# Altium schematic sheet PicoPrint-Power.SchDoc
size A3; DocumentNumber: 2; SheetNumber: 2; SheetTotal: 5
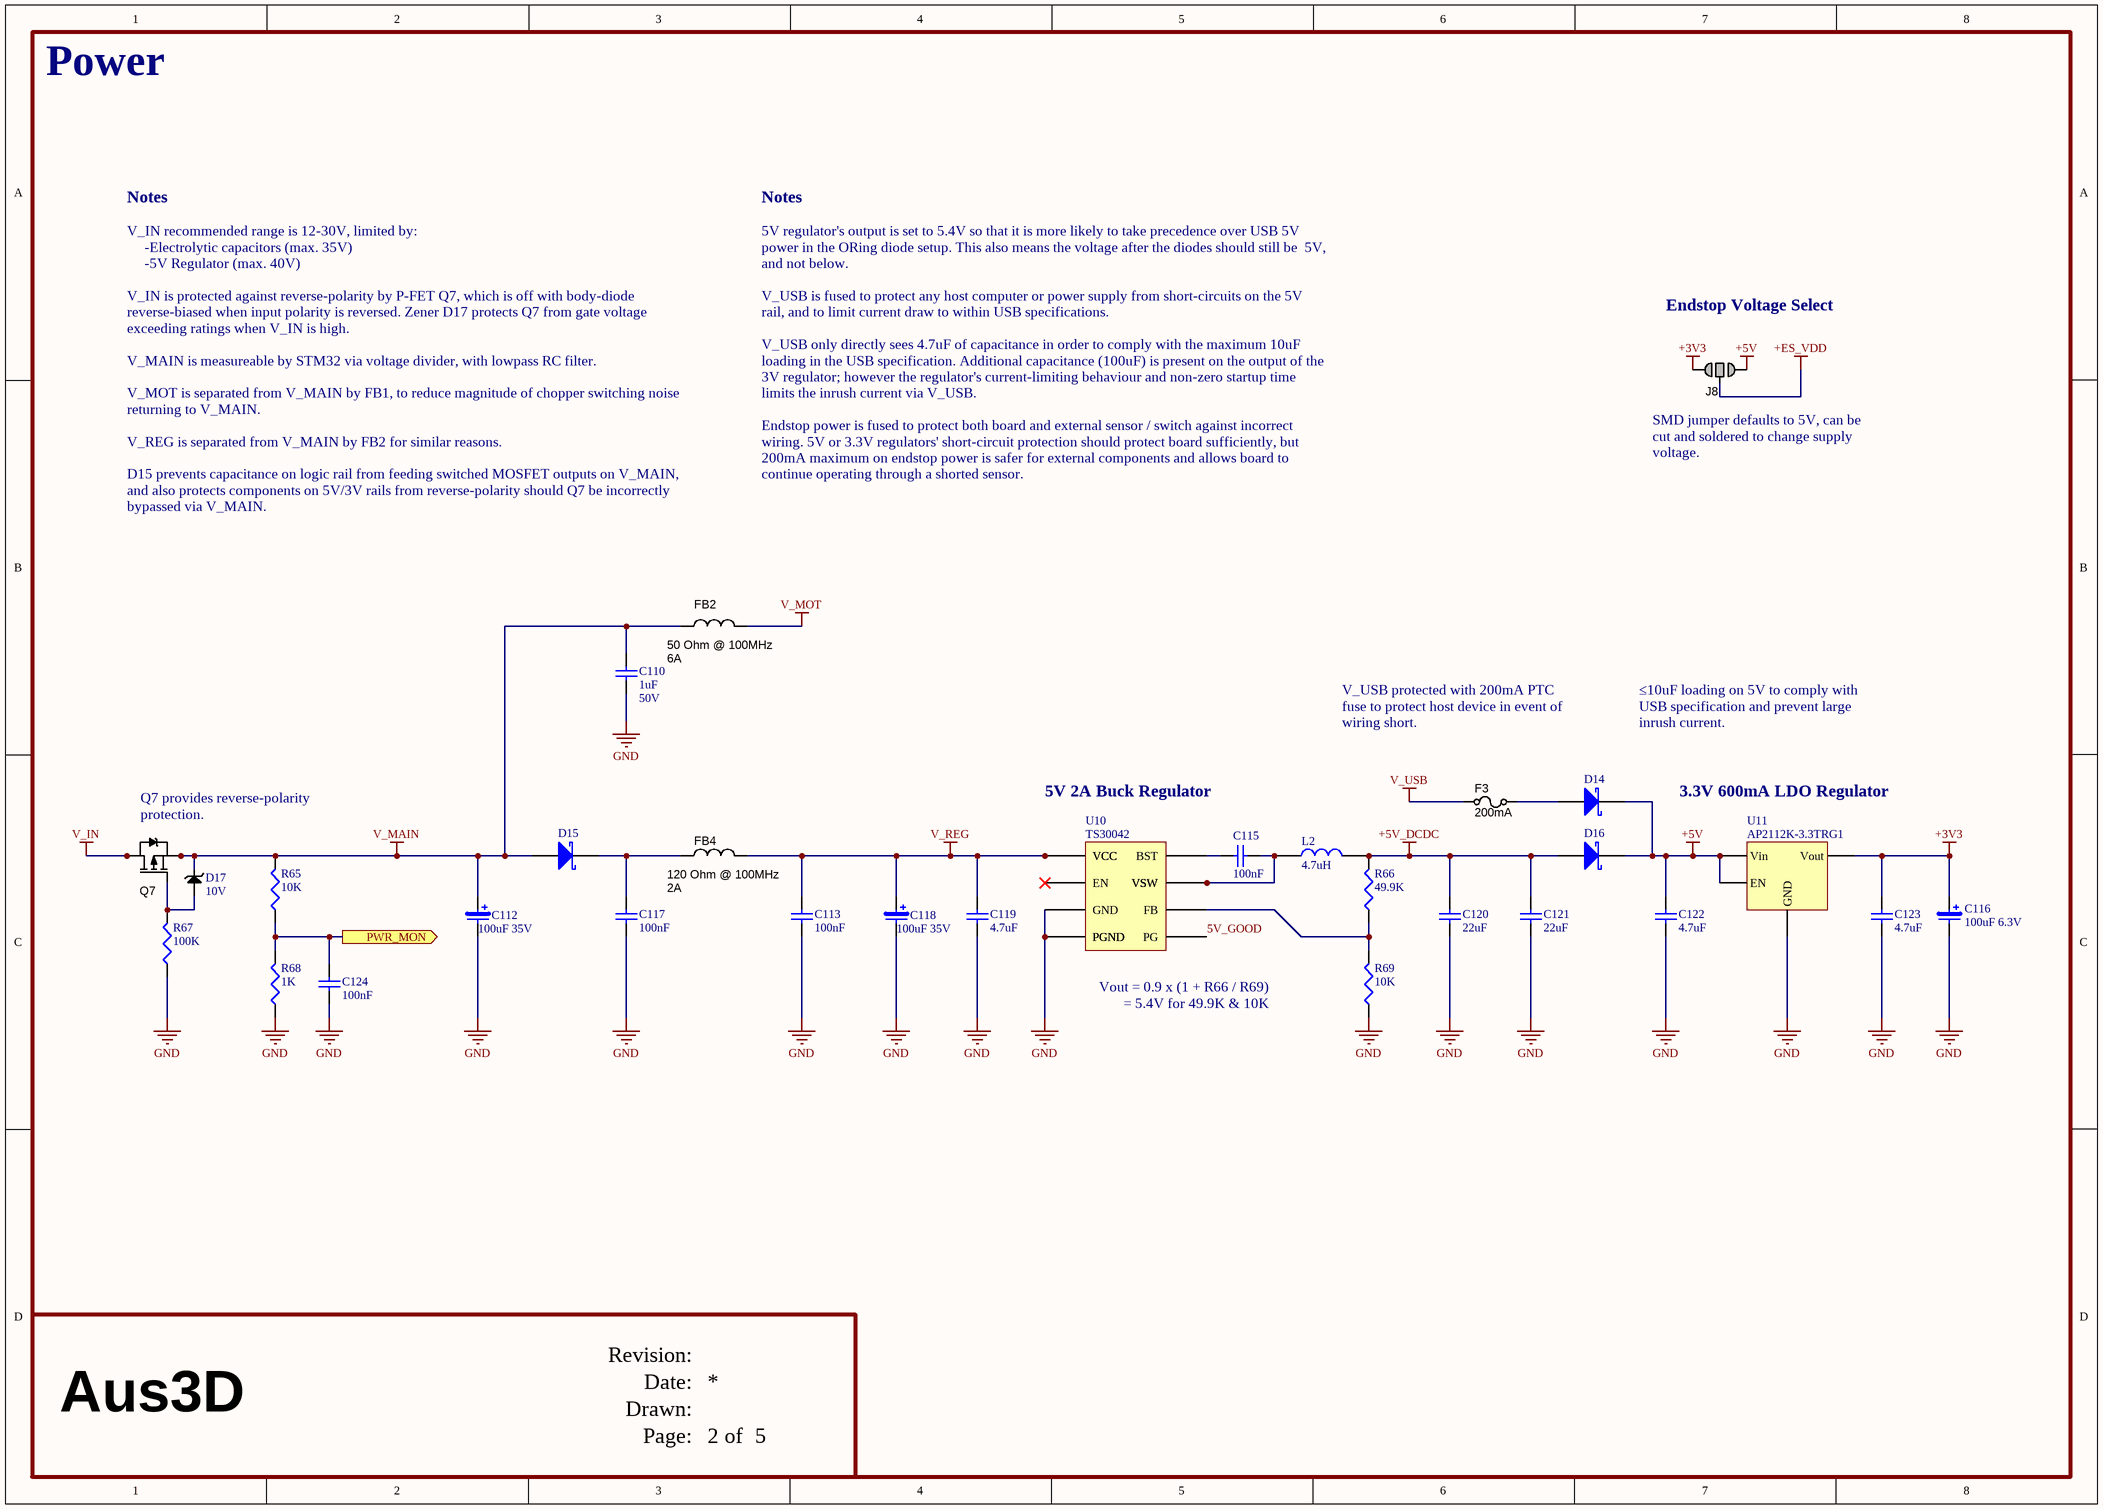
[diagram p0: PicoPrint-Power.SchDoc]

## Parts
C110  value 1uF  Voltage: 50V  [Cap 1608-0603]  (hidden comment: CapC-0603-1uF 50V)
C112  value 100uF 35V  [CAP EL PANASONIC]  (hidden comment: CapE-6.3-100uF-35V)
C113  value 100nF  [CAP 1005-0402]  (hidden comment: CapC-0402-100nF-50V)
C115  value 100nF  [CAP 1005-0402]  (hidden comment: CapC-0402-100nF)
C116  value 100uF 6.3V  [CAP EL 5mm]  (hidden comment: CapE-5.0-100uF-6.3V)
C117  value 100nF  [CAP 1005-0402]  (hidden comment: CapC-0402-100nF-50V)
C118  value 100uF 35V  [CAP EL PANASONIC]  (hidden comment: CapE-6.3-100uF-35V)
C119  value 4.7uF  [CAP 3225-1210]  (hidden comment: CapC-1210-4.7uF-50V)
C120  value 22uF  [CAPC2012X135N]  (hidden comment: CapC-0805-22uF 6.3V)
C121  value 22uF  [CAPC2012X135N]  (hidden comment: CapC-0805-22uF 6.3V)
C122  value 4.7uF  [CAP 1005-0402]  (hidden comment: CapC-0402-4.7uF-10V)
C123  value 4.7uF  [CAP 1005-0402]  (hidden comment: CapC-0402-4.7uF-10V)
C124  value 100nF  [CAP 1005-0402]  (hidden comment: CapC-0402-100nF)
D14  Schottky 2A 40V SOD-123F  [DIOM2616X08N]  (value not drawn)
D15  Schottky 2A 40V SOD-123F  [DIOM2616X08N]  (value not drawn)
D16  Schottky 2A 40V SOD-123F  [DIOM2616X08N]  (value not drawn)
D17  Voltage: 10V  [SOD523]  (hidden comment: Zener 10V 150mW SOD523)
F3  value 200mA  [RES 3216-1206]  (hidden comment: PTC Resettable Fuse)
FB2  Impedance @ Frequency: 50 Ohm @ 100MHz  Current Rating: 6A  [INDC3216X13N]  (hidden comment: 50R @ 100 MHz)
FB4  Impedance @ Frequency: 120 Ohm @ 100MHz  Current Rating: 2A  [INDC1608N]  (hidden comment: 120R @ 100 MHz)
J8  Jumper  [JUMPER-3-NO]  (value not drawn)  (no BOM)
L2  value 4.7uH  [INDUCTOR_NRS5030T4R7MMGJ]  (hidden comment: Inductor SMD 4.7uH 2.6A)
Q7  SI7111EDN-T1-GE3  [PowerPAK 1218-8 Single]  (value not drawn)
R65  value 10K  [RESC1005X40N]  (hidden comment: Res-0402-10K)
R66  value 49.9K  [RESC1005X40N]  (hidden comment: Res-0402-49.9K)
R67  value 100K  [RESC1005X40N]  (hidden comment: Res-0402-100K)
R68  value 1K  [RESC1005X40N]  (hidden comment: Res-0402-1K)
R69  value 10K  [RESC1005X40N]  (hidden comment: Res-0402-10K)
U10  TS30042  [QFN50P300X300X100_HS-17N]
U11  AP2112K-3.3TRG1  [SOT23-5]

## Ports
PWR_MON (out)

## Nets
+3V3: C116.1 C123.2 J8.1 U11.5(Vout)
+5V: C122.2 D14.K D16.K J8.3 U11.1(Vin) U11.3(EN)
+5V_DCDC: C120.2 C121.2 D16.A L2.2 R66.2
+ES_VDD: J8.2
GND: C110.1 C112.2 C113.1 C116.2 C117.1 C118.2 C119.1 C120.1 C121.1 C122.1 C123.1 C124.1 R67.1 R68.1 R69.1 U10.4(GND) U10.14(PGND) U10.15(PGND) U10.17(PGND) U11.2(GND)
V_IN: Q7.5(D) Q7.6(D) Q7.7(D) Q7.8(D) Q7.9(D)
V_MAIN: C110.2 C112.1 D15.A D17.K FB2.1 Q7.1(S) Q7.2(S) Q7.3(S) R65.2
V_MOT: FB2.2
V_REG: C113.2 C118.1 C119.2 FB4.2 U10.2(VCC) U10.3(VCC) U10.11(VCC)
V_USB: F3.1
5V_GOOD: U10.8(PG)
PWR_MON: C124.2 R65.1 R68.2 ; port PWR_MON
NetC115_1: C115.1 U10.10(BST)
NetC115_2: C115.2 L2.1 U10.1(VSW) U10.12(VSW) U10.13(VSW) U10.16(VSW)
NetC117_2: C117.2 D15.K FB4.1
NetD14_A: D14.A F3.2
NetD17_A: D17.A Q7.4(G) R67.2
NetR66_1: R66.1 R69.2 U10.5(FB)

Not connected (* = marked no-connect by the designer): U10 9(EN)*

## Notes on the sheet
- Power
- Notes
- Endstop Voltage Select
- 5V regulator's output is set to 5.4V so that it is more likely to take precedence over USB 5V power in the ORing diode setup. This also means the voltage after the diodes should still be  5V, and not below.
  V_USB is fused to protect any host computer or power supply from short-circuits on the 5V rail, and to limit current draw to within USB specifications.
  V_USB only directly sees 4.7uF of capacitance in order to comply with the maximum 10uF loading in the USB specification. Additional capacitance (100uF) is present on the output of the 3V regulator; however the regulator's current-limiting behaviour and non-zero startup time limits the inrush current via V_USB.
  Endstop power is fused to protect both board and external sensor / switch against incorrect wiring. 5V or 3.3V regulators' short-circuit protection should protect board sufficiently, but 200mA maximum on endstop power is safer for external components and allows board to continue operating through a shorted sensor.
- (near J8) SMD jumper defaults to 5V, can be cut and soldered to change supply voltage.
- V_IN recommended range is 12-30V, limited by:
  -Electrolytic capacitors (max. 35V)
  -5V Regulator (max. 40V)
  V_IN is protected against reverse-polarity by P-FET Q7, which is off with body-diode reverse-biased when input polarity is reversed. Zener D17 protects Q7 from gate voltage exceeding ratings when V_IN is high.
  V_MAIN is measureable by STM32 via voltage divider, with lowpass RC filter.
  V_MOT is separated from V_MAIN by FB1, to reduce magnitude of chopper switching noise returning to V_MAIN.
  V_REG is separated from V_MAIN by FB2 for similar reasons.
  D15 prevents capacitance on logic rail from feeding switched MOSFET outputs on V_MAIN, and also protects components on 5V/3V rails from reverse-polarity should Q7 be incorrectly bypassed via V_MAIN.
- V_USB protected with 200mA PTC fuse to protect host device in event of wiring short.
- ≤10uF loading on 5V to comply with USB specification and prevent large inrush current.
- Q7 provides reverse-polarity protection.
- 5V 2A Buck Regulator
- 3.3V 600mA LDO Regulator
- Vout = 0.9 x (1 + R66 / R69)
  = 5.4V for 49.9K & 10K
- Date:
- Revision:
- Aus3D
- Drawn:
- Page:
- of

## Library data of the parts
C110 = CapC-0603-1uF 50V: Capacitor (SMD Ceramic); Note: Approved sub OK; Published: 8-Jun-2000; Revision: July-2002: Re-released for DXP Platform.; Publisher: Altium Limited; Supplier 1: Digi-Key; Supplier Part Number 1: 1276-1860-1-ND
C112 C118 = CapE-6.3-100uF-35V: Capacitor (SMD Polarised Electrolytic); Note: Approved sub OK; Published: 8-Jun-2000; Revision: July-2002: Re-released for DXP Platform.; Publisher: Altium Limited; Supplier 1: Digi-Key; Supplier Part Number 1: PCE5016CT-ND
C113 C117 = CapC-0402-100nF-50V: Capacitor (SMD Ceramic); Voltage: 50V; Note: Approved sub OK; Published: 8-Jun-2000; Revision: July-2002: Re-released for DXP Platform.; Publisher: Altium Limited; Supplier 1: Digi-Key; Supplier Part Number 1: 490-10700-1-ND
C115 C124 = CapC-0402-100nF: Capacitor (SMD Ceramic); Note: Approved sub OK; Published: 8-Jun-2000; Revision: July-2002: Re-released for DXP Platform.; Publisher: Altium Limited; Supplier 1: Digi-Key; Supplier Part Number 1: 311-1336-1-ND
C116 = CapE-5.0-100uF-6.3V: Capacitor (SMD Polarised Electrolytic); Note: Approved sub OK; Published: 8-Jun-2000; Revision: July-2002: Re-released for DXP Platform.; Publisher: Altium Limited; Supplier 1: Digi-Key; Supplier Part Number 1: 565-2057-1-ND
C119 = CapC-1210-4.7uF-50V: Capacitor (SMD Ceramic); Note: Approved sub OK; Published: 8-Jun-2000; Revision: July-2002: Re-released for DXP Platform.; Publisher: Altium Limited; Supplier 1: Digi-Key; Supplier Part Number 1: 490-1864-1-ND
C120 C121 = CapC-0805-22uF 6.3V: Capacitor (SMD Ceramic); Note: Approved sub OK; Published: 8-Jun-2000; Revision: July-2002: Re-released for DXP Platform.; Publisher: Altium Limited; Supplier 1: Digi-Key; Supplier Part Number 1: 1276-6460-1-ND
C122 C123 = CapC-0402-4.7uF-10V: Capacitor (SMD Ceramic); Voltage: 10V; Note: Approved sub OK; Published: 8-Jun-2000; Revision: July-2002: Re-released for DXP Platform.; Publisher: Altium Limited; Supplier 1: Digi-Key; Supplier Part Number 1: 1276-1482-1-ND
D14-D16 = Diode Schottky 2A 40V (SS24FL): Diode (SMD); Code - JEDEC: DO-214-AB; Note: Approved sub OK; Published: 8-Jun-2000; Revision: July-2002: Re-released for DXP Platform.; Publisher: Altium Limited; Supplier 1: Digi-Key; Supplier Part Number 1: SS24FLCT-ND
D17 = Diode Zener 10V: Diode (SMD); Code - JEDEC: DO-214-AB; Note: Approved sub OK; Published: 8-Jun-2000; Revision: July-2002: Re-released for DXP Platform.; Publisher: Altium Limited; Supplier 1: Digi-Key; Supplier Part Number 1: DZ2S100M0LCT-ND
F3 = Fuse - 30V 400mA Trip PTC SMD 1206: Note: Approved sub OK; Package / Case: 1206 (3216 metric); Supplier 1: Digi-Key; Supplier Part Number 1: 507-1797-1-ND
FB2 = FERRITE_50R-100MHz_1206: Ferrite bead 50 Ohm at 100 MHz 6A 1206 SMD; Number of Lines: 1; Note: Approved sub OK; Applications: Power Supplies; Operating Temperature: -40°C ~ 105°C; Mounting Type: Surface Mount; Height (Max): 0.037" (0.95mm); Value: 50R @ 100 MHz; Supplier 1: Digi-Key; Supplier Part Number 1: 240-2412-1-ND
FB4 = FERRITE_120R-100MHz_0603: Ferrite bead 120 Ohm at 100 MHz 2A 0603 SMD; Manufacturer 1: Murata Electronics North America; Manufacturer Part Number 1: BLM18PG121SN1D; Current: 900mA; DC Resistance (DCR): 172.9 mOhm Max; Frequency - Self Resonant: 23MHz; Frequency - Test: 100kHz; Filter Type: Differential Mode - Single; Number of Lines: 1; Ratings: 2 A; 50 mO DC; SCDType: source; Note: Approved sub OK; Current - Saturation: 900mA; Current - Temperature Rise: 900mA; Applications: Power Supplies; Package / Case: 1210 (3225 Metric); Operating Temperature: -40°C ~ 105°C; ComponentLink1URL: http://www.yuden.co.jp/ut/product/pdf/wound02_e.pdf; ComponentLink1Description: http://www.yuden.co.jp/ut/product/pdf/wound02_e.pdf; Supplier 1: Digi-Key; Supplier Part Number 1: 490-1037-1-ND; Mounting Type: Surface Mount; Height (Max): 0.037" (0.95mm); Size / Dimension: 0.063" L x 0.031" W (1.60mm x 0.80mm); ComponentLink2URL: http://search.murata.co.jp/Ceramy/image/img/PDF/ENG/L0110S0100BLM18P.pdf; ComponentLink2Description: http://search.murata.co.jp/Ceramy/image/img/PDF/ENG/L0110S0100BLM18P.pdf; Value: 120R @ 100 MHz
J8 = JUMP3-NO: SMD jumper
L2 = Inductor SMD 4.7uH 2.6A: 4.7µH Shielded Wirewound Inductor 2.6A 35 mOhm Nonstandard; Note: Approved sub OK; Published: 24-Mar-1999; Revision: July-2002: Re-released for DXP Platform.; Publisher: Altium Limited; Supplier 1: Digi-Key; Supplier Part Number 1: 587-3461-1-ND
Q7 = MOSFET - SI7111EDN-T1-GE3: MOSFET SMD P-CH 30V 60A PowerPAK1212; FET Type: MOSFET P-Channel, Metal Oxide; Supplier 1: Digi-Key; Supplier Part Number 1: SI7111EDN-T1-GE3CT-ND
R65 R69 = Res-0402-10K: Resistor; Note: Approved sub OK; Published: 8-Jun-2000; Revision: July-2002: Re-released for DXP Platform.; Publisher: Altium Limited; Supplier 1: Digi-Key; Supplier Part Number 1: 311-10KJRCT-ND
R66 = Res-0402-49.9K: Resistor; Note: Approved sub OK; Published: 8-Jun-2000; Revision: July-2002: Re-released for DXP Platform.; Publisher: Altium Limited; Supplier 1: Digi-Key; Supplier Part Number 1: 311-2296-1-ND
R67 = Res-0402-100K: Resistor; Note: Approved sub OK; Published: 8-Jun-2000; Revision: July-2002: Re-released for DXP Platform.; Publisher: Altium Limited; Supplier 1: Digi-Key; Supplier Part Number 1: 311-100KJRCT-ND
R68 = Res-0402-1K: Resistor; Note: Approved sub OK; Published: 8-Jun-2000; Revision: July-2002: Re-released for DXP Platform.; Publisher: Altium Limited; Supplier 1: Digi-Key; Supplier Part Number 1: 311-1.0KJRCT-ND
U10 = Regulator - TS30042 Buck Regulator: Buck Regulator; Supplier 1: Digi-Key; Supplier Part Number 1: TS30042-M000QFNRCT-ND
U11 = Regulator - AP2112K 3.3V Linear Regulator: 3.3V LDO Regulator; Supplier 1: Digi-Key; Supplier Part Number 1: AP2112K-3.3TRG1DICT-ND